# Altium schematic sheet Main Power.SchDoc
size 297 x 209 mm; SheetNumber: 2; SheetTotal: 29
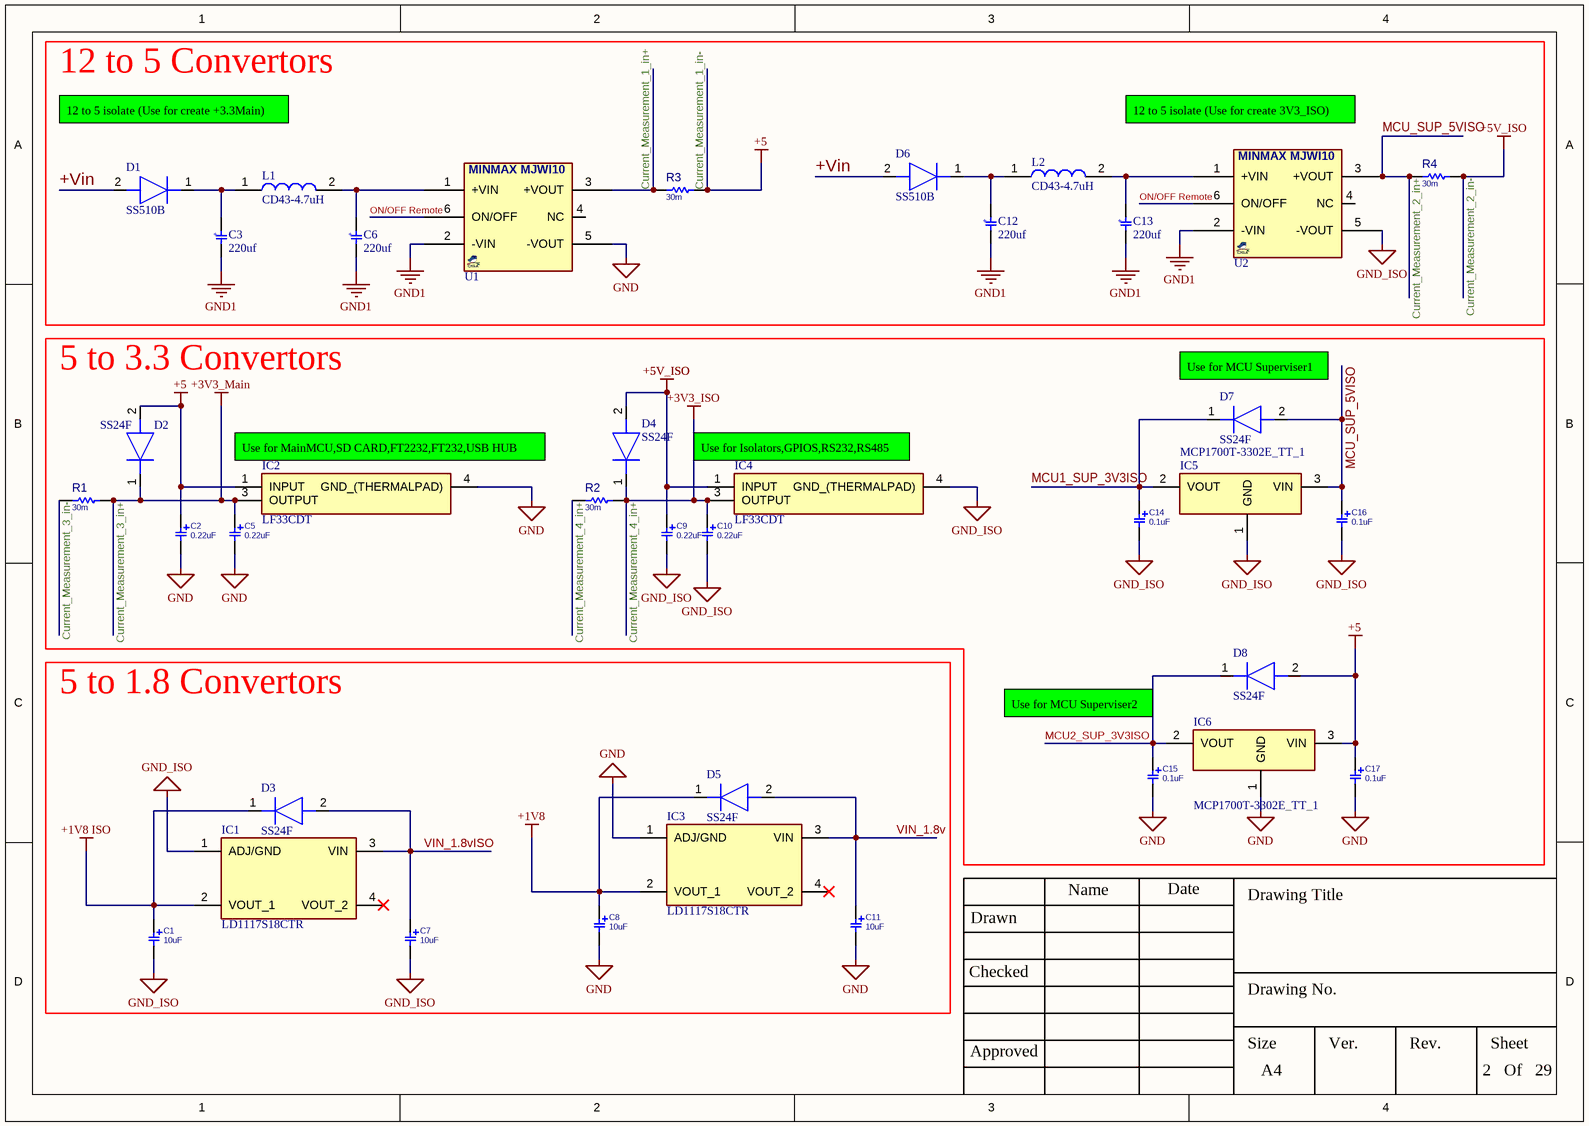
[diagram p0: Main Power.SchDoc]

## Parts
C1  10uF  [C_TN_3528]
C2  0.22uF  [C_TN_3528]
C3  value 220uf  [Cap_D]  (hidden comment: Capacitor Tantalum SMD)
C5  0.22uF  [C_TN_3528]
C6  value 220uf  [Cap_D]  (hidden comment: Capacitor Tantalum SMD)
C7  10uF  [C_TN_3528]
C8  10uF  [C_TN_3528]
C9  0.22uF  [C_TN_3528]
C10  0.22uF  [C_TN_3528]
C11  10uF  [C_TN_3528]
C12  value 220uf  [Cap_D]  (hidden comment: Capacitor Tantalum SMD)
C13  value 220uf  [Cap_D]  (hidden comment: Capacitor Tantalum SMD)
C14  0.1uF  [C_TN_3528]
C15  0.1uF  [C_TN_3528]
C16  0.1uF  [C_TN_3528]
C17  0.1uF  [C_TN_3528]
D1  SS510B  [DIOM5336X244N]
D2  SS24F  [SODFL4626X110N]
D3  SS24F  [SODFL4626X110N]
D4  SS24F  [SODFL4626X110N]
D5  SS24F  [SODFL4626X110N]
D6  SS510B  [DIOM5336X244N]
D7  SS24F  [SODFL4626X110N]
D8  SS24F  [SODFL4626X110N]
IC1  LD1117S18CTR  [SOT230P700X180-4N]
IC2  LF33CDT  [TO228P972X240-3N]
IC3  LD1117S18CTR  [SOT230P700X180-4N]
IC4  LF33CDT  [TO228P972X240-3N]
IC5  MCP1700T-3302E_TT_1  [SOT95P237X112-3N]
IC6  MCP1700T-3302E_TT_1  [SOT95P237X112-3N]
L1  CD43-4.7uH  [CD43NP220MC]
L2  CD43-4.7uH  [CD43NP220MC]
R1  30m  [R2512]
R2  30m  [R2512]
R3  30m  [R2512]
R4  30m  [R2512]
U1  MJWI10-24S05  [MINMAX_MJWI10]  (value not drawn)
U2  MJWI10-24S05  [MINMAX_MJWI10]  (value not drawn)

## Blocks framed on the sheet
12 to 5 Convertors: C3 C6 C12 C13 D1 D6 L1 L2 R3 R4 U1 U2
5 to 3.3 Convertors: C2 C5 C9 C10 C14-C17 D2 D4 D7 D8 IC2 IC4-IC6 R1 R2
5 to 1.8 Convertors: C1 C7 C8 C11 D3 D5 IC1 IC3

## Nets
+1V8: C8.1 D5.1(K) IC3.2(VOUT_1)
+1V8 ISO: C1.1 D3.1(K) IC1.2(VOUT_1)
Current_Measurement_1_in-: C2.1 C17.1 D2.2(A) D8.2(A) IC2.1(INPUT) IC6.3(VIN) R3.2  [also labelled +5]
Current_Measurement_2_in-: C9.1 D4.2(A) IC4.1(INPUT) R4.2  [also labelled +5V_ISO]
Current_Measurement_3_in+: C5.1 D2.1(K) IC2.3(OUTPUT) R1.2  [also labelled +3V3_Main]
Current_Measurement_4_in+: C10.1 D4.1(K) IC4.3(OUTPUT) R2.1 R2.2  [also labelled +3V3_ISO]
GND: C2.2 C5.2 C8.2 C11.2 C15.2 C17.2 IC2.4(GND_(THERMALPAD)) IC3.1(ADJ/GND) IC6.1(GND) U1.5(-VOUT)
GND1: C3.1 C6.1 C12.1 C13.1 U1.2(-VIN) U2.2(-VIN)
GND_ISO: C1.2 C7.2 C9.2 C10.2 C14.2 C16.2 IC1.1(ADJ/GND) IC4.4(GND_(THERMALPAD)) IC5.1(GND) U2.5(-VOUT)
+Vin: D1.2(A) D6.2(A)
Current_Measurement_1_in+: R3.1 U1.3(+VOUT)
Current_Measurement_2_in+: C16.1 D7.2(A) IC5.3(VIN) R4.1 U2.3(+VOUT)  [also labelled MCU_SUP_5VISO]
Current_Measurement_3_in-: R1.1
MCU1_SUP_3V3ISO: C14.1 D7.1(K) IC5.2(VOUT)
MCU2_SUP_3V3ISO: C15.1 D8.1(K) IC6.2(VOUT)
ON/OFF Remote: U1.6(ON/OFF) U2.6(ON/OFF)
VIN_1.8v: C11.1 D5.2(A) IC3.3(VIN)
VIN_1.8vISO: C7.1 D3.2(A) IC1.3(VIN)
NetC3_2: C3.2 D1.1(K) L1.1
NetC6_2: C6.2 L1.2 U1.1(+VIN)
NetC12_2: C12.2 D6.1(K) L2.1
NetC13_2: C13.2 L2.2 U2.1(+VIN)

Not connected (* = marked no-connect by the designer): IC1 4(VOUT_2)*; IC3 4(VOUT_2)*; U1 4(NC); U2 4(NC)

## Notes on the sheet
- 12 to 5 isolate (Use for create +3.3Main)
- 12 to 5 isolate (Use for create 3V3_ISO)
- (near D7) Use for MCU Superviser1
- (near IC2) Use for MainMCU,SD CARD,FT2232,FT232,USB HUB
- (near IC4) Use for Isolators,GPIOS,RS232,RS485
- Use for MCU Superviser2
- Drawn
- Name
- Date
- Drawing Title
- Checked
- Drawing No.
- Approved
- Size
- A4
- Ver.
- Rev.
- Sheet
- Of
- (in symbol Capacitor Tantalum SMD) +
- (in symbol MJWI10-24S05) MINMAX MJWI10

## Library data of the parts
C1 C2 C5 C7-C11 C14-C17 = CAP_SMD_TAN: CAP, SMD, TAN,; PARAM2: -V
  C1 C7 C8 C11: VALUE: 10uF
  C2 C5 C9 C10: VALUE: 0.22uF
  C14-C17: VALUE: 0.1uF
D1 D6 = SS510B: Diode; Manufacturer_Name: HY Electronic; Height: 2.44mm; Manufacturer_Part_Number: SS510B
D2-D5 D7 D8 = SS24F: Diode; Manufacturer_Name: Shikues; Datasheet Link: https://eastronic88.en.made-in-china.com/print/FZStilOdyghn/China-Schottky-Barrier-Rectifier-Diode-SS24F-2-0A-40V-SMAF.html; Height: 1.1mm; Manufacturer_Part_Number: SS24F
IC1 IC3 = LD1117S18CTR: Integrated Circuit; Manufacturer_Name: STMicroelectronics; Datasheet Link: http://www.st.com/st-web-ui/static/active/en/resource/technical/document/datasheet/CD00000544.pdf; Height: 1.8mm; Manufacturer_Part_Number: LD1117S18CTR; Mouser Part Number: 511-LD1117S18CTR; Mouser Price/Stock: https://www.mouser.co.uk/ProductDetail/STMicroelectronics/LD1117S18CTR?qs=qolwYojYp3Sa3BPkKnJupg%3D%3D; Arrow Part Number: LD1117S18CTR; Arrow Price/Stock: https://www.arrow.com/en/products/ld1117s18ctr/stmicroelectronics?region=nac
IC2 IC4 = LF33CDT: Integrated Circuit; Manufacturer_Name: STMicroelectronics; Datasheet Link: http://www.st.com/web/en/resource/technical/document/datasheet/CD00000546.pdf; Height: 2.4mm; Manufacturer_Part_Number: LF33CDT; Mouser Part Number: 511-LF33CDT; Mouser Price/Stock: https://www.mouser.co.uk/ProductDetail/STMicroelectronics/LF33CDT?qs=tZUCD5p2VWo1sRQNOfAbrg%3D%3D
IC5 IC6 = MCP1700T-3302E_TT_1: Integrated Circuit; Manufacturer_Name: Microchip; Manufacturer_Part_Number: MCP1700T-3302E/TT; Datasheet Link: https://datasheet.datasheetarchive.com/originals/distributors/SFDatasheet-4/sf-00090030.pdf; Height: 1.12mm; Mouser Part Number: 579-MCP1700T3302E/TT; Mouser Price/Stock: https://www.mouser.co.uk/ProductDetail/Microchip-Technology/MCP1700T-3302E-TT?qs=fM4xO01eazPmCNDrdHEdaw%3D%3D; Arrow Part Number: MCP1700T-3302E/TT; Arrow Price/Stock: https://www.arrow.com/en/products/mcp1700t-3302ett/microchip-technology?region=europe
L1 L2 = CD43NP-220MC: Inductor; Manufacturer_Name: Sumida; Datasheet Link: https://products.sumida.com/products/pdf/CD43.pdf; Height: 3.5mm; Manufacturer_Part_Number: CD43NP-220MC; Mouser Part Number: 851-CD43NP-220MC; Mouser Price/Stock: https://www.mouser.co.uk/ProductDetail/Sumida/CD43NP-220MC?qs=ttApTud31JYLH5yY3TuJPg%3D%3D; Arrow Part Number: CD43NP-220MC; Arrow Price/Stock: https://www.arrow.com/en/products/cd43np-220mc/sumida?region=nac
R1-R4 = RES_SMD_2512: RESISTOR, SMD; PARAM: -W; DESC: DESCRIPTION; DIST#: MOUSER; PARAM2: 1%; MANF_P#: -; MANF: -; ASSEMBLY: ASSEMBLY; PRICE: 100= 0.5$; VALUE: 30m
U1 U2 = MJWI10-24S05: DC-DC Converter, Isolated, 10W; MANF: MINMAX; PARAM2: 9~36(24)Vin, 5Vout, 10W; PARAM: 2000mA, -40~80°C; DESC: https://www.minmax.com.tw/en/download/files/546/MJWI10_Datasheet.pdf; MANF_P#: MJWI10-24S05; VALUE: MJWI10-24S05
C3 C6 C12 C13 = Capacitor Tantalum SMD: DatasheetVersion: 2021; ComponentLink1Description: Website Smart World; ComponentLink1URL: https://www.smartw.ir/; ComponentLink2Description: Telegram; ComponentLink2URL: https://t.me/altium_smartw; ComponentLink3Description: Instagram; ComponentLink3URL: https://Instagram.com/smartgw.ir